# EAGLE design receiver-4x (EAGLE 6.5.0)
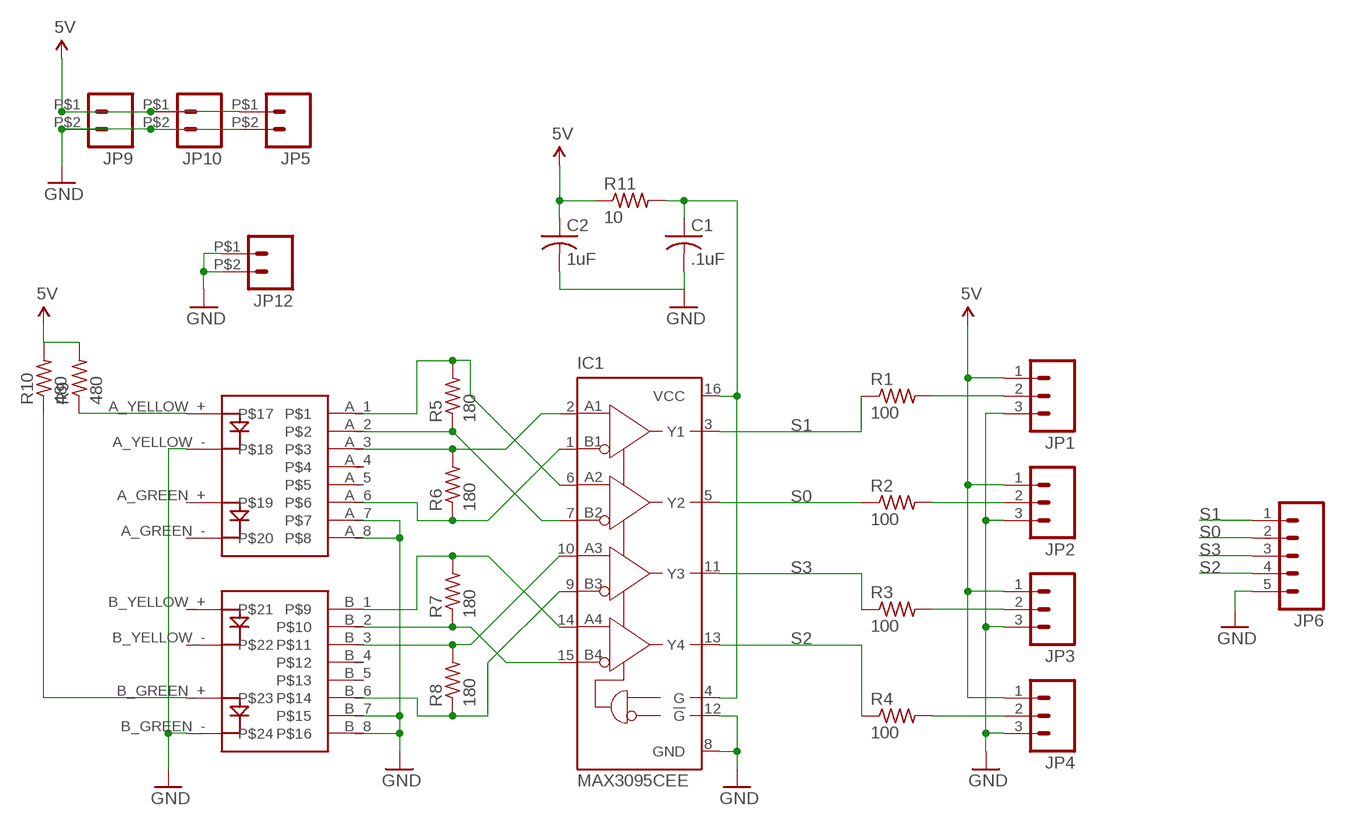
[diagram p0: schematic, sheet 1]

## Parts
C1  .1uF  C-USC0603  [C0603]
C2  1uF  C-USC0603  [C0603]
IC1  MAX3095CEE  [QSOP16]
JP1  M03SCREW-DETACH  [SCREWTERMINAL-5MM-3-DETACHABLE]
JP2  M03SCREW-DETACH  [SCREWTERMINAL-5MM-3-DETACHABLE]
JP3  M03SCREW-DETACH  [SCREWTERMINAL-5MM-3-DETACHABLE]
JP4  M03SCREW-DETACH  [SCREWTERMINAL-5MM-3-DETACHABLE]
JP5  M026.35MM  [SCREWTERMINAL-6.35MM-2]
JP6  M05PTH  [1X05]
JP9  M026.35MM  [SCREWTERMINAL-6.35MM-2]
JP10  M026.35MM  [SCREWTERMINAL-6.35MM-2]
JP12  M026.35MM  [SCREWTERMINAL-6.35MM-2]
R1  100  R-US_R0603  [R0603]
R2  100  R-US_R0603  [R0603]
R3  100  R-US_R0603  [R0603]
R4  100  R-US_R0603  [R0603]
R5  180  R-US_R0603  [R0603]
R6  180  R-US_R0603  [R0603]
R7  180  R-US_R0603  [R0603]
R8  180  R-US_R0603  [R0603]
R9  480  R-US_R0603  [R0603]
R10  480  R-US_R0603  [R0603]
R11  10  R-US_R0603  [R0603]
U$1  RJ45_2X1  [RJ45_2X1]

## Nets
5V: C2.1 JP1.1 JP2.1 JP3.1 JP4.1 JP5.P$1 JP9.P$1 JP10.P$1 R9.2 R10.2 R11.1
GND: C1.2 C2.2 IC1.8(GND) IC1.12(!G) JP1.3 JP2.3 JP3.3 JP4.3 JP5.P$2 JP6.5 JP9.P$2 JP10.P$2 JP12.P$1 JP12.P$2 U$1.A_7 U$1.A_8 U$1.A_YELLOW_- U$1.B_7 U$1.B_8 U$1.B_GREEN_-
N$1: JP1.2 R1.2
N$2: IC1.6(A2) R5.2 U$1.A_1
N$3: IC1.7(B2) R5.1 U$1.A_2
N$4: JP2.2 R2.2
N$5: JP3.2 R3.2
N$6: JP4.2 R4.2
N$8: IC1.2(A1) R6.2 U$1.A_3
N$9: IC1.1(B1) R6.1 U$1.A_6
N$10: IC1.14(A4) R7.2 U$1.B_1
N$11: IC1.15(B4) R7.1 U$1.B_2
N$12: IC1.10(A3) R8.2 U$1.B_3
N$13: IC1.9(B3) R8.1 U$1.B_6
N$14: R9.1 U$1.A_YELLOW_+
N$15: R10.1 U$1.B_GREEN_+
N$16: C1.1 IC1.4(G) IC1.16(VCC) R11.2
S0: IC1.5(Y2) JP6.2 R2.1
S1: IC1.3(Y1) JP6.1 R1.1
S2: IC1.13(Y4) JP6.4 R4.1
S3: IC1.11(Y3) JP6.3 R3.1
Unconnected: U$1.A_4 U$1.A_5 U$1.A_GREEN_+ U$1.A_GREEN_- U$1.B_4 U$1.B_5 U$1.B_YELLOW_+ U$1.B_YELLOW_-

## Library data of the parts
C1 C2 = adafruit:C-US: CAPACITOR, American symbol
IC1 = LEDscape:MAX309*: ±15kV ESD-Protected, 10Mbps, 3V/5V, Quad RS-422/RS-485 Receivers Source: http://pdfserv.maxim-ic.com/en/ds/MAX3095-MAX3096.pdf; MPN: MAX3095CEE+; OC_FARNELL: unknown; OC_NEWARK: 67K4748
JP1-JP4 = LEDscape:M03: Header 3 Standard 3-pin 0.1" header. Use with straight break away headers (SKU : PRT-00116), right angle break away headers (PRT-00553), swiss pins (PRT-00743), machine pins (PRT-00117), and female headers (PRT-00115). Molex polarized connector foot print use with SKU : PRT-08232 with associated crimp pins and housings.
JP5 JP9 JP10 JP12 = SparkFun:M02: Header 2 Standard 2-pin 0.1" header. Use with straight break away headers (SKU : PRT-00116), right angle break away headers (PRT-00553), swiss pins (PRT-00743), machine pins (PRT-00117), and female headers (PRT-00115). Molex polarized connector foot print use with SKU : PRT-08233 with associated crimp pins and housings.
JP6 = SparkFun-Connectors:M05: Header 5 Standard 5-pin 0.1" header. Use with straight break away headers (SKU : PRT-00116), right angle break away headers (PRT-00553), swiss pins (PRT-00743), machine pins (PRT-00117), and female headers (PRT-00115). Molex polarized connector foot print use with SKU : PRT-08230 with associated crimp pins and housings.
R1-R11 = adafruit:R-US_: RESISTOR, American symbol
U$1 = LEDscape:RJ45_2X1

## Board
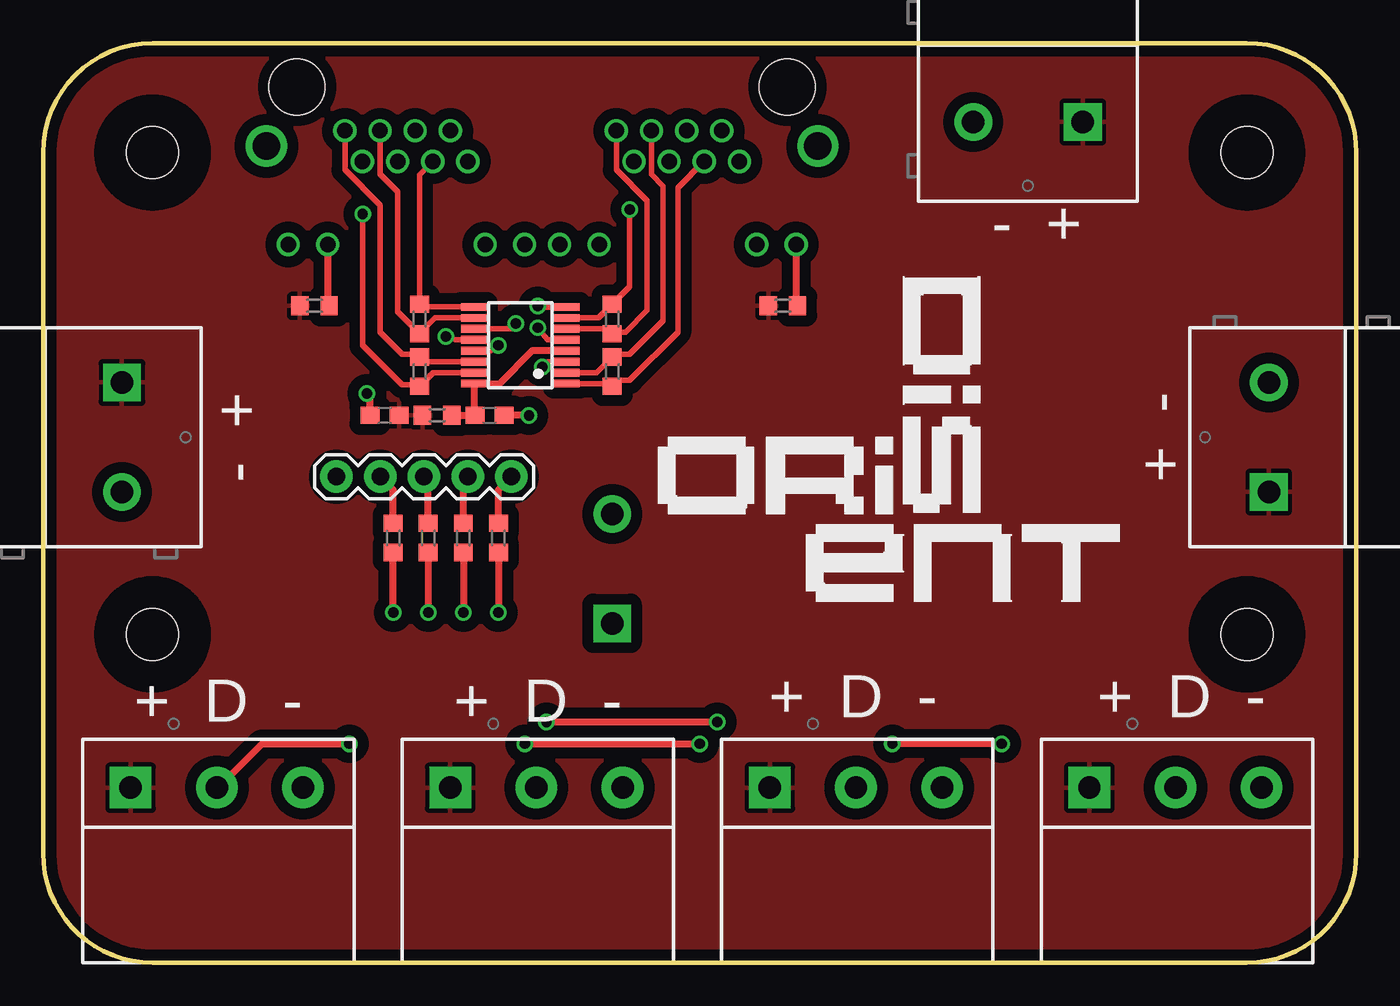
[diagram p1: board, top side]
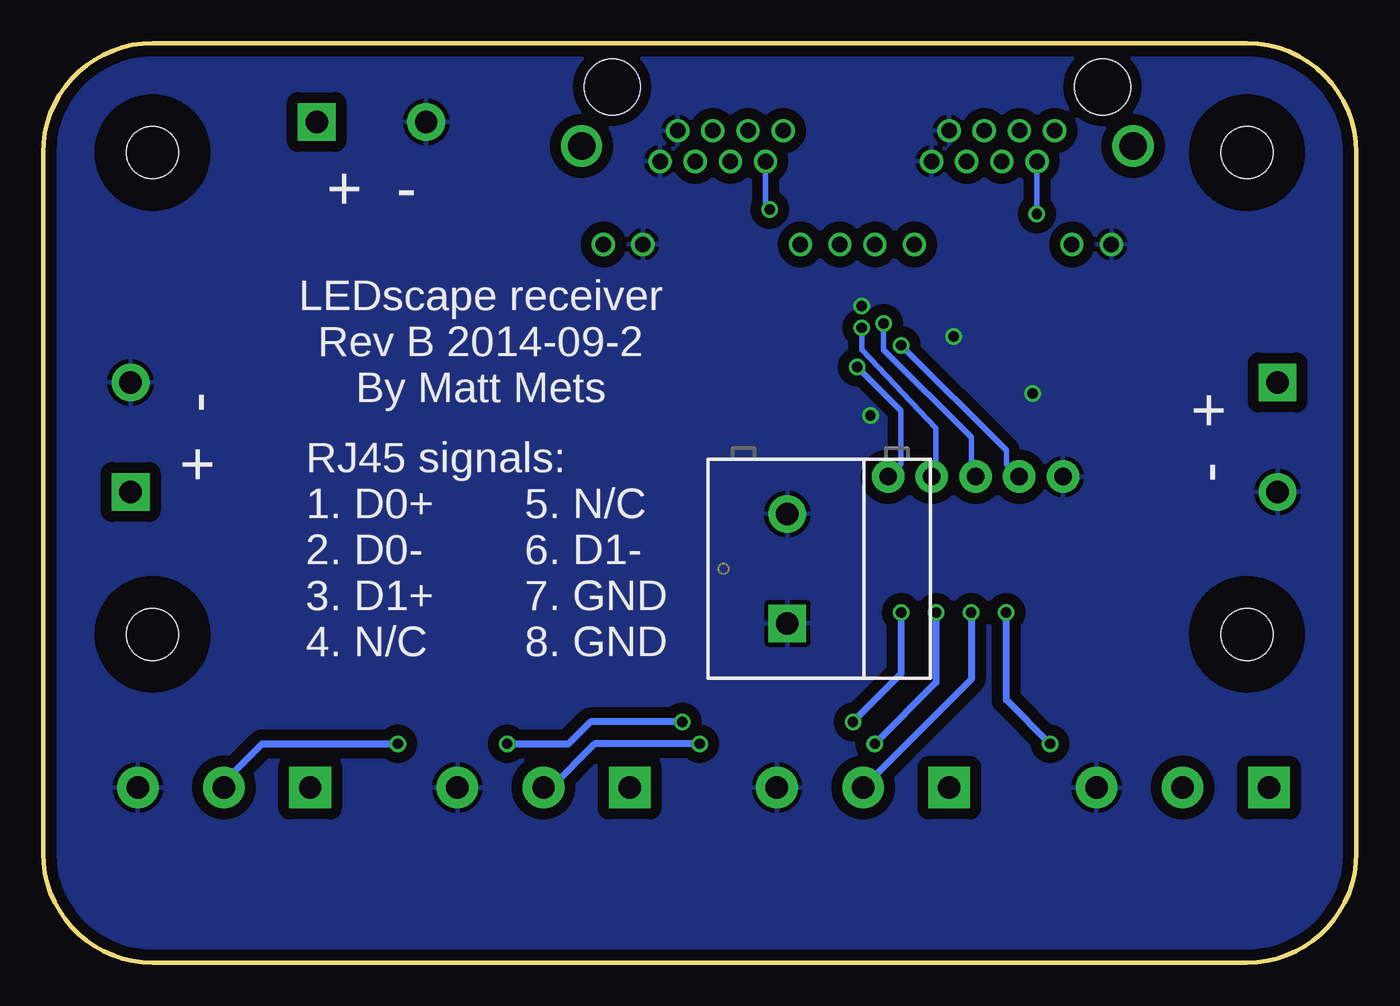
[diagram p2: board, bottom side, seen from below]

Size 76.2 x 53.34 mm. Coordinates in mm from the lower left corner, seen from the top.
Outline: 69.85,53.34 6.35,53.34 arc90 0,46.99 0,6.35 arc90 6.35,0 69.85,0 arc90 76.2,6.35 76.2,46.98 arc90 69.85,53.34
Copper layers (1*16): Top 0.0356mm / dielectric 1.5011mm / Bottom 0.0356mm
Design rules "LaenPCBOrder *": minimum track width 6mil, minimum drill 13mil, track to track 6mil, track to pad 6mil, pad to pad 6mil, via to via 6mil, smd to smd 6mil, copper to edge 15mil, drill to drill 6mil, minimum pad ring 7mil, minimum via ring 7mil, stop-mask expansion 4mil, vias tented up to drill 2mm, thermal gap 10mil
Holes 3 mm at 6.35,46.99 6.35,19.05 69.85,19.05 69.85,46.99
tRestrict: area 67.3,44.4 to 72.4,49.5; area 67.3,16.5 to 72.4,21.6; area 3.8,44.4 to 8.9,49.5; area 3.8,16.5 to 8.9,21.6
bRestrict: area 3.8,16.5 to 8.9,21.6; area 3.8,44.4 to 8.9,49.5; area 67.3,16.5 to 72.4,21.6; area 67.3,44.4 to 72.4,49.5

### Footprints (pad centres in the part's own frame; a part is rotated, then mirrored left to right if it is on the bottom)
C0603 = smd 1.1 x 1: 1 -0.85,0; 2 0.85,0
QSOP16 = smd 0.45 x 1.5: 1 -2.223,-2.69; 2 -1.587,-2.69; 3 -0.953,-2.69; 4 -0.318,-2.69; 5 0.318,-2.69; 6 0.953,-2.69; 7 1.587,-2.69; 8 2.223,-2.69; 9 2.223,2.69; 10 1.587,2.69; 11 0.953,2.69; 12 0.318,2.69; 13 -0.318,2.69; 14 -0.953,2.69; 15 -1.587,2.69; 16 -2.223,2.69
SCREWTERMINAL-5MM-3-DETACHABLE = drill 1.3 pad 2.413 square: 1 0,0 | drill 1.3 pad 2.413: 2 5,0; 3 10,0
SCREWTERMINAL-6.35MM-2 = drill 1.3 pad 2.184 square: P$1 -3.175,0 | drill 1.3 pad 2.184: P$2 3.175,0
1X05 = drill 1.016 pad 1.88: 1 0,0; 2 2.54,0; 3 5.08,0; 4 7.62,0; 5 10.16,0
R0603 = smd 1 x 1.1: 1 -0.85,0; 2 0.85,0
RJ45_2X1 = drill 0.9: A_1 -4.305,2.54; A_2 -5.325,4.32; A_3 -6.345,2.54; A_4 -7.365,4.32; A_5 -8.385,2.54; A_6 -9.405,4.32; A_7 -10.425,2.54; A_8 -11.445,4.32; A_GREEN_+ -3.305,9.14; A_GREEN_- -1.015,9.14; A_YELLOW_+ -14.735,9.14; A_YELLOW_- -12.445,9.14; B_1 11.445,2.54; B_2 10.425,4.32; B_3 9.405,2.54; B_4 8.385,4.32; B_5 7.365,2.54; B_6 6.345,4.32; B_7 5.325,2.54; B_8 4.305,4.32; B_GREEN_+ 12.445,9.14; B_GREEN_- 14.735,9.14; B_YELLOW_+ 1.015,9.14; B_YELLOW_- 3.305,9.14 | drill 1.6: P$3 -16,3.43; P$6 16,3.43 | hole 3.25: -14.225,0; 14.225,0

### Placement (x,y rotation side)
C1  25.91,31.75 0 top
C2  19.81,31.75 180 top
IC1  27.69,35.81 90 top
JP1  60.71,10.16 0 top
JP2  42.16,10.16 0 top
JP3  23.62,10.16 0 top
JP4  5.08,10.16 0 top
JP5  4.57,30.48 270 top
JP6  27.18,28.19 180 top
JP9  71.12,30.48 90 top
JP10  57.15,48.77 180 top
JP12  33.02,22.86 90 bottom
R1  26.42,24.64 270 top
R2  24.38,24.64 270 top
R3  22.35,24.64 270 top
R4  20.32,24.64 270 top
R5  33.02,37.34 270 top
R6  33.02,34.29 90 top
R7  21.84,34.29 90 top
R8  21.84,37.34 270 top
R9  42.93,38.1 180 top
R10  15.75,38.1 180 top
R11  22.86,31.75 0 top
U$1  28.96,50.8 180 top
U$3  [DISORIENT_LOGO]  49.53,28.45 270 top

### Tracks (layer width: path | path; a pad name or v marks a point on that pad's centre or on a via)
5V
  pour Top (isolate 0.635): 0,0 0,53.34 76.2,53.34 76.2,0
GND  (via drill 0.6)
  Top 0.305: v23.37,36.32 23.94,36.13 IC1.12
  Top 0.406: IC1.8 28.89,38.04 v28.7,38.1 | v28.19,31.75 C1.2 | C2.2 18.96,32.85 v18.8,33.02
  pour Bottom (isolate 0.635): 0,0 0,53.34 76.2,53.34 76.2,0
N$1  (via drill 0.6)
  Top 0.406: v55.63,12.7 v49.28,12.7 | R1.2 v26.42,20.32 | v29.21,13.97 v39.12,13.97
  Bottom 0.406: JP1.2 65.71,10.49 63.5,12.7 v55.63,12.7 | v49.28,12.7 45.72,12.7 44.45,13.97 v39.12,13.97 | v26.42,20.32 26.42,16.76 v29.21,13.97
N$2
  Top 0.305: IC1.6 32.74,36.77 R5.2 33.11,36.58 33.78,36.58 35.05,37.85 35.05,44.2 33.26,45.99 U$1.A_1
N$3  (via drill 0.6)
  Top 0.305: IC1.7 32.23,37.4 R5.1 34.04,39.2 v34.04,43.69
  Bottom 0.305: U$1.A_2 34.28,43.95 v34.04,43.69
N$4  (via drill 0.6)
  Top 0.406: R2.2 v24.38,20.32 | v27.94,12.7 v38.1,12.7
  Bottom 0.305: JP2.2 46.74,10.16
  Bottom 0.406: 46.74,10.16 44.2,12.7 v38.1,12.7 | v24.38,20.32 24.38,16.26 v27.94,12.7
N$5  (via drill 0.6)
  Top 0.406: R3.2 v22.35,20.32
  Bottom 0.406: v22.35,20.32 22.35,16.43 JP3.2
N$6  (via drill 0.6)
  Top 0.305: JP4.2 10.16,10.16
  Top 0.406: 10.16,10.16 12.7,12.7 v17.78,12.7 | v20.32,20.32 R4.2
  Bottom 0.406: v17.78,12.7 20.32,15.24 v20.32,20.32
N$8
  Top 0.305: IC1.2 32.11,34.23 R6.2 33.19,35.31 34.04,35.31 35.98,37.25 35.98,45.05 35.31,45.72 U$1.A_3
N$9
  Top 0.305: IC1.1 32.87,33.59 R6.1 33.36,33.78 34.04,33.78 36.83,36.58 36.83,44.96 U$1.A_6
N$10
  Top 0.305: IC1.14 22.12,34.86 | U$1.B_1 17.51,45.99 19.56,43.94 19.56,36.58 20.83,35.31 21.68,35.31
  Top 0.406: 22.12,34.86 R7.2 21.68,35.31
N$11  (via drill 0.6)
  Top 0.305: IC1.15 22.63,34.23 R7.1 | v18.54,43.43 18.54,35.81 20.83,33.53 21.76,33.53
  Top 0.406: 21.76,33.53 R7.1
  Bottom 0.305: U$1.B_2 18.53,43.45
  Bottom 0.406: 18.53,43.45 v18.54,43.43
N$12
  Top 0.305: IC1.10 22.76,37.4 R8.2 20.57,37.76 20.57,44.7 19.55,45.73 U$1.B_3
N$13
  Top 0.305: IC1.9 22,38.04 R8.1 21.84,45.71 U$1.B_6
N$14
  Top 0.406: U$1.A_YELLOW_+ 43.69,38.19 R9.1
N$15
  Top 0.406: U$1.B_GREEN_+ 16.51,38.7 R10.1
N$16
  Top 0.305: 25,31.81 C1.1
  Top 0.406: 25,31.81 IC1.16 26.48,33.59 28.38,35.5 IC1.4 | R11.2 C1.1
S0  (via drill 0.6)
  Top 0.305: v28.7,36.83 29.27,36.13 IC1.5
  Top 0.406: R2.1 24.38,27.94 JP6.2
  Bottom 0.305: v28.7,36.83 28.7,35.56 24.38,30.99 24.38,28.45 JP6.2
S1  (via drill 0.6)
  Top 0.305: IC1.3 29.27,34.86 v28.96,34.54
  Top 0.406: R1.1 26.42,27.43 JP6.1
  Bottom 0.305: v28.96,34.54 26.42,32 26.42,28.96 JP6.1
S2  (via drill 0.6)
  Top 0.305: IC1.13 25.97,35.5 v26.42,35.81
  Top 0.406: R4.1 20.32,27.43 JP6.4
  Bottom 0.305: v26.42,35.81 20.32,29.72 20.32,28.96 JP6.4
S3  (via drill 0.6)
  Top 0.305: IC1.11 27.11,36.77 v27.43,37.08
  Top 0.406: R3.1 22.35,27.94 JP6.3
  Bottom 0.305: v27.43,37.08 27.43,35.56 22.35,30.48 22.35,28.45 JP6.3

### Text on the board
tNames: - + | - + | + - | + D - | + D - | + D - | + D -
bNames: + - | LEDscape receiver / Rev B 2014-09-2 / By Matt Mets | - + | + - | 5. N/C / 6. D1- / 7. GND / 8. GND | RJ45 signals: / 1. D0+ / 2. D0- / 3. D1+ / 4. N/C